# Altium schematic sheet Power.SchDoc
size A3
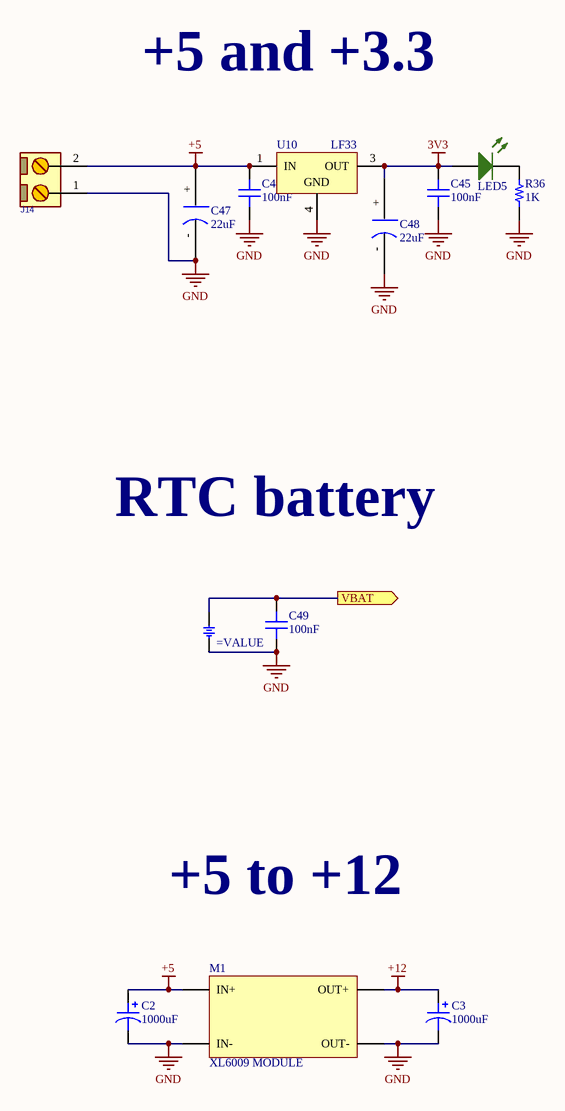
[diagram p0: Power.SchDoc]

## Parts
BT1  (no value)  [BTH1220]
C2  1000uF  [CAP ALTH D12.5 L5 H14]
C3  1000uF  [CAP ALTH D12.5 L5 H14]
C44  100nF  [CAP 0805_2012]
C45  100nF  [CAP 0805_2012]
C47  22uF  [CAP_6.3x7.7]
C48  22uF  [CAP_6.3x7.7]
C49  100nF  [CAP 0805_2012]
J14  Phoenix MSTBV 2Pin  [PHOENIX MSTBV_2]  (value not drawn)
LED5  LED SMD 0805 GREEN  [LED_0805_GREEN]  (value not drawn)
M1  XL6009 MODULE  [XL6009]
R36  1K  [RES 0805_2012]
U10  LF33  [TO-252]

## Ports
VBAT (out)

## Nets
3V3: C45.2 C48.+ LED5.1(A) U10.3(OUT)
+5: C2.1 C44.2 C47.+ J14.2 M1.1(IN+) U10.1(IN)
+12: C3.1 M1.3(OUT+)
GND: BT1.2 C2.2 C3.2 C44.1 C45.1 C47.- C48.- C49.2 J14.1 M1.2(IN-) M1.4(OUT-) R36.1 U10.4(GND)
VBAT: BT1.1 C49.1 ; port VBAT
NetLED5_2: LED5.2(K) R36.2

## Notes on the sheet
- +5 and +3.3
- RTC battery
- +5 to +12

## Library data of the parts
BT1 = Battery CR1220 (SMD) S8411-45R: Battery Holder (Open) Coin, 12.0mm 1 Cell SMD (SMT) Tab; PartNumber: S8411-45R
C2 C3 = Cap Alu TH D12.5mm L5mm H14mm: TH Aluminum Polymer Capacitor; VALUE: 10uF 6.3V
C44 C45 C49 = Cap 0805: SMT Capacitor; VALUE: 100nF
C47 C48 = Cap Alu 6.3x7.7mm: SMD Aluminum Capacitor 6.3x7.7mm
J14 = Phoenix MSTBV 2Pin: CONN, PHOENIX MSTBV, 5-G, 5.08mm pitch; PartNumber: MSTBV 2,5/ 2-G-5,08 - 1758018
M1 = XL6009 MODULE: XL6009 MODULE DC STEP UP
R36 = Res 0805: SMT Resistor; VALUE: 1K
U10 = LF33 (SMD): 500mA, Very Low Drop (0.45V) Voltage Regulator, 3.3V, 3-Pin DPAK, Tape and Reel; PartNumber: LF33CDT-TR; DatasheetVersion: Nov-2010; PackageVersion: 2011; PackageReference: TO-252; PackageDescription: 3-Pin Transistor Outline Package 2.28 mm Pitch, 9.7 mm Lead Span (DPAK); ComponentLink1Description: Manufacturer URL; ComponentLink1URL: http://www.st.com; ComponentLink2Description: Datasheet; ComponentLink2URL: http://www.st.com/internet/com/TECHNICAL_RESOURCES/TECHNICAL_LITERATURE/DATASHEET/CD00000546.pdf